# EAGLE design working (EAGLE 8.7.0)
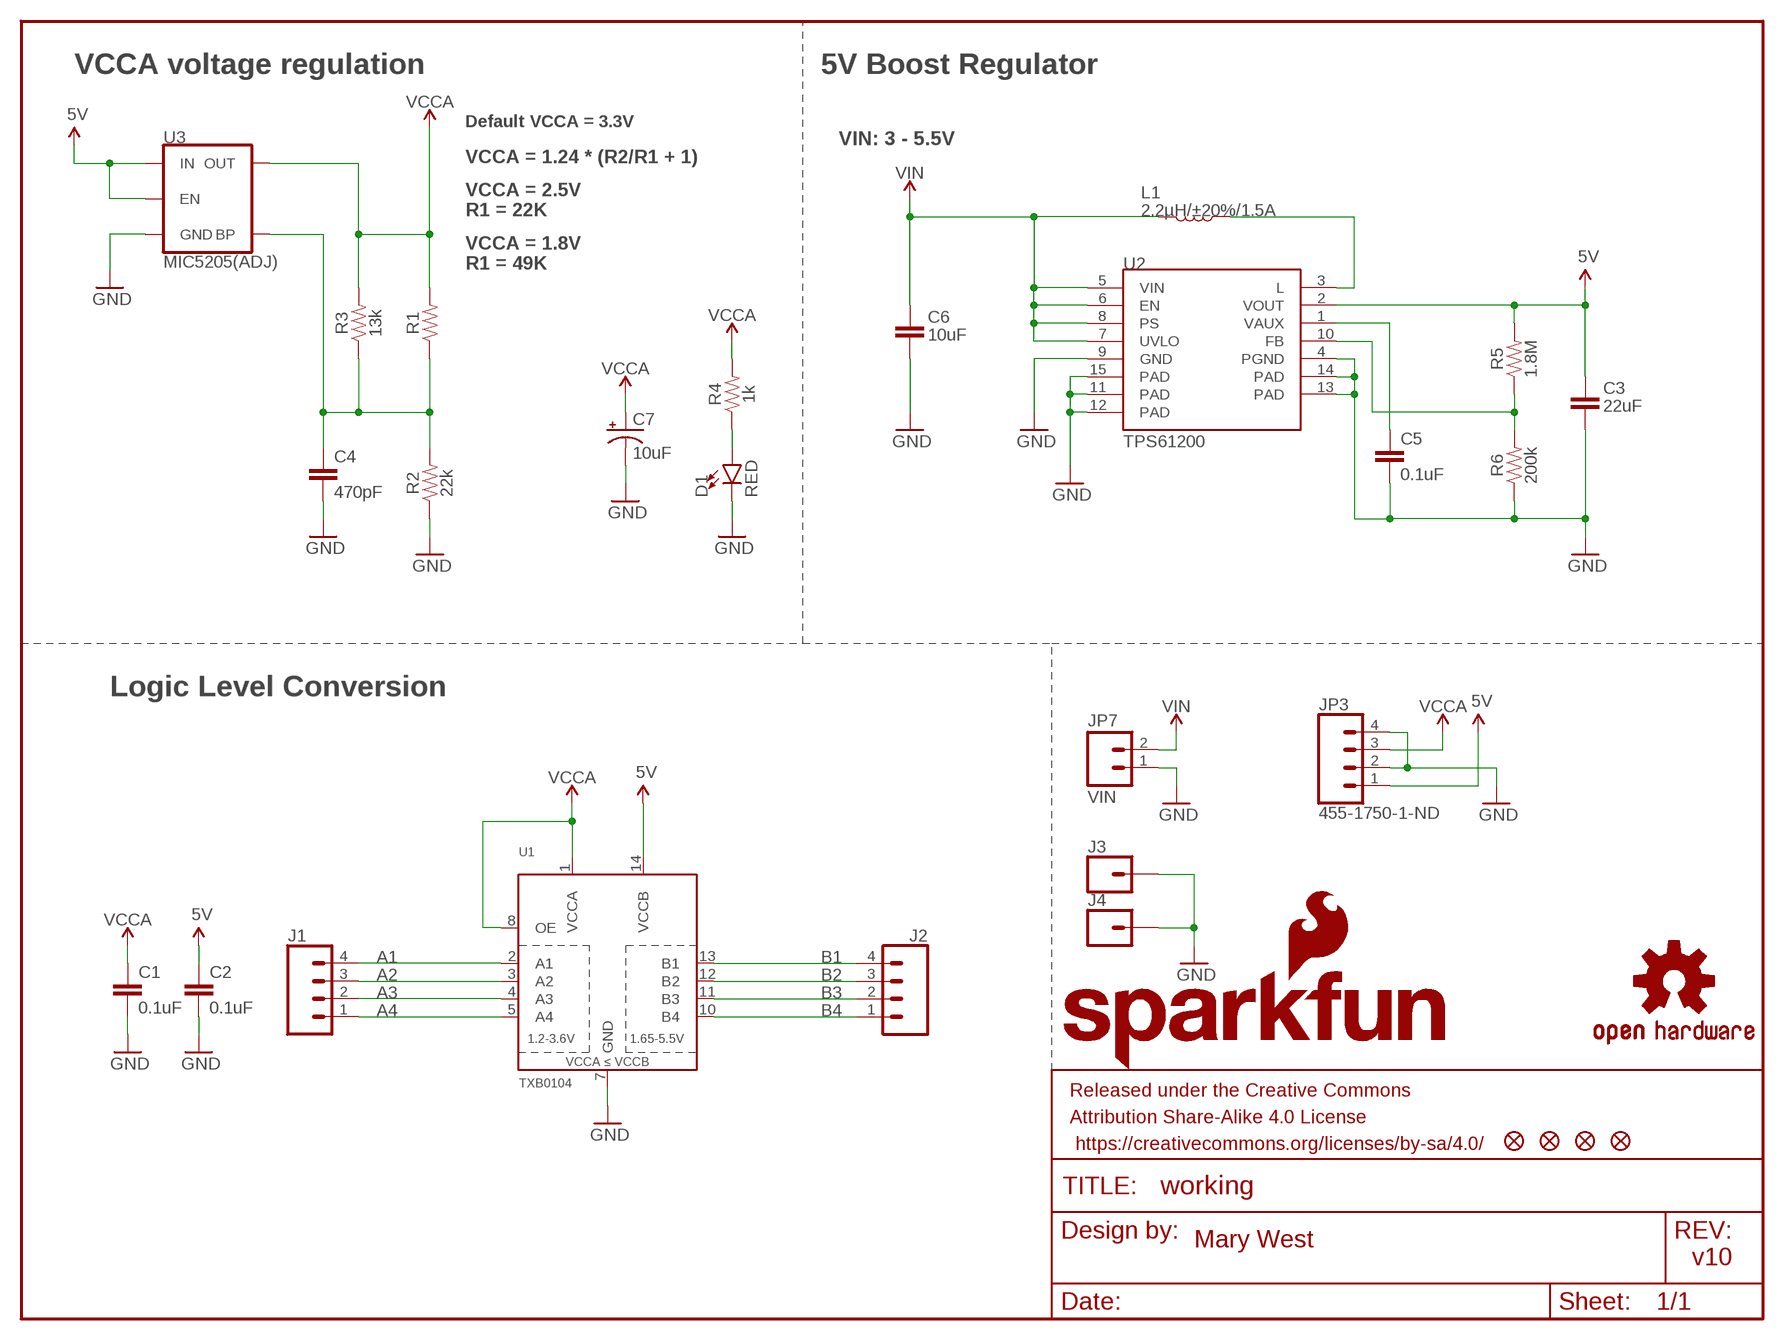
[diagram p0: schematic, sheet 1]

## Parts
C1  0.1uF  0.1UF-25V(+80/-20%)(0603)  [0603-CAP]
C2  0.1uF  0.1UF-25V(+80/-20%)(0603)  [0603-CAP]
C3  22uF  22UF-0805-6.3V-20%  [0805]
C4  470pF  470PF-0603-50V-5%  [0603]
C5  0.1uF  0.1UF-0603-25V-(+80/-20%)  [0603]
C6  10uF  10UF-0603-6.3V-20%  [0603]
C7  10uF  10UF-POLAR-EIA3216-16V-10%(TANT)  [EIA3216]
D1  RED  LED-RED0603  [LED-0603]
FD1  FIDUCIALUFIDUCIAL  [FIDUCIAL-MICRO]
FD2  FIDUCIALUFIDUCIAL  [FIDUCIAL-MICRO]
FD3  FIDUCIALUFIDUCIAL  [FIDUCIAL-MICRO]
FD4  FIDUCIALUFIDUCIAL  [FIDUCIAL-MICRO]
FRAME1  FRAME-LETTER  [CREATIVE_COMMONS]
J1  CONN_04  [1X04]
J2  CONN_04  [1X04]
J3  CONN_01  [1X01]
J4  CONN_01  [1X01]
JP3  455-1750-1-ND  CONN_04  [1X04]
JP7  VIN  M02PTH  [1X02]
L1  2.2µH/±20%/1.5A  INDUCTOR-VLF4012AT-2.2UH  [INDUCTOR_2.2UH]
LOGO1  SFE_LOGO_NAME_FLAME.1_INCH  [SFE_LOGO_NAME_FLAME_.1]
LOGO2  OSHW-LOGOS  [OSHW-LOGO-S]
R1  RESISTORAXIAL-0.3  [AXIAL-0.3]
R2  22k  22KOHM-0603-1/10W-1%  [0603]
R3  13k  13KOHM-0603-1/10W-1%  [0603]
R4  1k  1KOHM-0603-1/10W-1%  [0603]
R5  1.8M  1.8MOHM  [0603]
R6  200k  200KOHM-0603-1/10W-1%  [0603]
U1  TXB0104  TXB0104PWR  [TSSOP14]
U2  TPS61200  [QFN-10_PAD]
U3  MIC5205(ADJ)  V_REG_MIC5205ADJ  [SOT23-5]

## Nets
5V: C2.1 C3.1 JP3.1 R5.2 U1.14(VCCB) U2.2(VOUT) U3.1(IN) U3.3(EN)
A1: J1.4 U1.2(A1)
A2: J1.3 U1.3(A2)
A3: J1.2 U1.4(A3)
A4: J1.1 U1.5(A4)
B1: J2.4 U1.13(B1)
B2: J2.3 U1.12(B2)
B3: J2.2 U1.11(B3)
B4: J2.1 U1.10(B4)
FB: R5.1 R6.2 U2.10(FB)
GND: C1.2 C2.2 C3.2 C4.2 C5.2 C6.2 C7.- D1.C J3.1 J4.1 JP3.2 JP3.4 JP7.1 R2.1 R6.1 U1.7(GND) U2.4(PGND) U2.9(GND) U2.11(PAD) U2.12(PAD) U2.13(PAD) U2.14(PAD) U2.15(PAD) U3.2(GND)
N$3: D1.A R4.1
N$5: L1.P$1 U2.3(L)
N$6: C5.1 U2.1(VAUX)
N$11: C4.1 R1.P$1 R2.2 R3.1 U3.4(BP)
VCCA: C1.1 C7.+ JP3.3 R1.P$2 R3.2 R4.2 U1.1(VCCA) U1.8(OE) U3.5(OUT)
VIN: C6.1 JP7.2 L1.P$2 U2.5(VIN) U2.6(EN) U2.7(UVLO) U2.8(PS)

## Notes on the sheet
- VCCA voltage regulation | 5V Boost Regulator
- Default VCCA = 3.3V
- VIN: 3 - 5.5V
- VCCA = 1.24 * (R2/R1 + 1)
- VCCA = 2.5V
  R1 = 22K
- VCCA = 1.8V
  R1 = 49K
- Logic Level Conversion
- Mary West
- v10

## Library data of the parts
C1 C2 = SparkFun-Capacitors:0.1UF-25V(+80/-20%)(0603): Ceramic Standard decoupling cap CAP-00810; PROD_ID: CAP-00810
C3 = SparkFun-Capacitors:22UF: 22µF ceramic capacitors A capacitor is a passive two-terminal electrical component used to store electrical energy temporarily in an electric field.; PROD_ID: CAP-08402
C4 = SparkFun-Capacitors:470PF: 470pF ceramic capacitors A capacitor is a passive two-terminal electrical component used to store electrical energy temporarily in an electric field.; PROD_ID: CAP-07884
C5 = SparkFun-Capacitors:0.1UF: 0.1µF ceramic capacitors A capacitor is a passive two-terminal electrical component used to store electrical energy temporarily in an electric field.; PROD_ID: CAP-00810
C6 = SparkFun-Capacitors:10UF: 10.0µF ceramic capacitors A capacitor is a passive two-terminal electrical component used to store electrical energy temporarily in an electric field.; PROD_ID: CAP-11015
C7 = SparkFun-Capacitors:10UF-POLAR: 10.0µF polarized capacitors A capacitor is a passive two-terminal electrical component used to store electrical energy temporarily in an electric field.; PROD_ID: CAP-00811
D1 = SparkFun-LED:LED-RED: Red SMD LED Used in manufacturing of most products at SparkFun Packages: 0603 - SMD 0603 package [Product Link] <http://docs.avagotech.com/docs/AV02-0551EN> 0603 SMART - SMD 0603 SMART package ( more efficient and expensive)[Product Link] <http://www.osram-os.com/Graphics/XPic2/00077099_0.pdf> 1206 - SMD1206 package [Product Link] <https://www.sparkfun.com/datasheets/DevTools/LilyPad/Q150OVS4.pdff> SparkFun Products: Pro Mini 328 -5V <https://www.sparkfun.com/products/821> RedBoard <https://www.sparkfun.com/products/12757> IOIO-OTG <https://www.sparkfun.com/products/13613>; PROD_ID: DIO-00819
FD1-FD4 = SparkFun-Aesthetics:FIDUCIAL: Fiducial Alignment Points Point-of-reference for pick-and-place machines and other optical instruments.
FRAME1 = SparkFun-Aesthetics:FRAME-LETTER: Schematic Frame - Letter Standard 8.5x11 US Letter frame
J1 J2 JP3 = SparkFun-Connectors:CONN_04: Multi connection point. Often used as Generic Header-pin footprint for 0.1 inch spaced/style header connections On any of the 0.1 inch spaced packages, you can populate with these: Break Away Headers - Straight <https://www.sparkfun.com/products/116> (PRT-00116) Break Away Male Headers - Right Angle <https://www.sparkfun.com/products/553> (PRT-00553) Female Headers <https://www.sparkfun.com/products/115> (PRT-00115) Break Away Headers - Machine Pin <https://www.sparkfun.com/products/117> (PRT-00117) Break Away Female Headers - Swiss Machine Pin <https://www.sparkfun.com/products/743> (PRT-00743) For SCREWTERMINALS and SPRING TERMINALS visit here: Screw Terimnals on SparkFun.com <https://www.sparkfun.com/search/results?term=Screw+Terminals> (5mm/3.5mm/2.54mm spacing) This device is also useful as a general connection point to wire up your design to another part of your project. Our various solder wires solder well into these plated through hole pads. Hook-Up Wire - Assortment (Stranded, 22 AWG) <https://www.sparkfun.com/products/11375> (PRT-11375) Hook-Up Wire - Assortment (Solid Core, 22 AWG) <https://www.sparkfun.com/products/11367> (PRT-11367) View the entire wire category on our website here <https://www.sparkfun.com/categories/141> Special notes: Molex polarized connector foot print use with SKU : PRT-08231 with associated crimp pins and housings. 1MM SMD Version SKU: PRT-10208; PROD_ID: CONN-09696
J3 J4 = SparkFun-Connectors:CONN_01: Single connection point. Often used as Generic Header-pin footprint for 0.1 inch spaced/style header connections On any of the 0.1 inch spaced packages, you can populate with these: Break Away Headers - Straight <https://www.sparkfun.com/products/116> (PRT-00116) Break Away Male Headers - Right Angle <https://www.sparkfun.com/products/553> (PRT-00553) Female Headers <https://www.sparkfun.com/products/115> (PRT-00115) Break Away Headers - Machine Pin <https://www.sparkfun.com/products/117> (PRT-00117) Break Away Female Headers - Swiss Machine Pin <https://www.sparkfun.com/products/743> (PRT-00743) This device is also useful as a general connection point to wire up your design to another part of your project. Our various solder wires solder well into these plated through hole pads. Hook-Up Wire - Assortment (Stranded, 22 AWG) <https://www.sparkfun.com/products/11375> (PRT-11375) Hook-Up Wire - Assortment (Solid Core, 22 AWG) <https://www.sparkfun.com/products/11367> (PRT-11367) View the entire wire category on our website here <https://www.sparkfun.com/categories/141> Special notes: SMTSO-256-ET is a "flush mount" nut for a 4-40 screw. We mostly use this on specialty testbeds; it is a nice way to connect hardware to your PCB at an adjustable hieght. Also note, the SNAP packages are for using a snappable style connector. We sell a baggie of snaps and they are also used on two LilyPad designs: Snap Assortment - 30 pack (male and female) <https://www.sparkfun.com/products/11347> (DEV-11347) LilyPad Arduino SimpleSnap <https://www.sparkfun.com/products/10941> (DEV-10941) LilyPad SimpleSnap Protoboard <https://www.sparkfun.com/products/10940> (DEV-10940)
JP7 = SparkFun:M02: Header 2 Standard 2-pin 0.1" header. Use with straight break away headers (SKU : PRT-00116), right angle break away headers (PRT-00553), swiss pins (PRT-00743), machine pins (PRT-00117), and female headers (PRT-00115). Molex polarized connector foot print use with SKU : PRT-08233 with associated crimp pins and housings.
L1 = SparkFun-Coils:INDUCTOR: Inductors Resist changes in electrical current. Basically a coil of wire. SparkFun Products: SparkFun Load Cell Amplifier - HX711 <https://www.sparkfun.com/products/13879> IOIO-OTG - V2.2 <https://www.sparkfun.com/products/13613>; PROD_ID: NDUC-09513
LOGO1 = SparkFun-Aesthetics:SFE_LOGO_NAME_FLAME: SparkFun Font Logo w/ Flame This is the SparkFun full logo. The logo on the schematic will always be the same size; the package variant is the height of the flame part of the logo. Default layer for the logo on the board is tSilk.
LOGO2 = SparkFun-Aesthetics:OSHW-LOGO: Open-Source Hardware (OSHW) Logo This logo indicates the piece of hardware it is found on incorporates a OSHW license and/or adheres to the definition of open source hardware found here: http://freedomdefined.org/OSHW
R1 = SparkFun-Resistors:RESISTOR: Generic Resistor Package
R2 = SparkFun-Resistors:22KOHM: 22kΩ resistor A resistor is a passive two-terminal electrical component that implements electrical resistance as a circuit element. Resistors act to reduce current flow, and, at the same time, act to lower voltage levels within circuits. - Wikipedia; PROD_ID: RES-07853
R3 = SparkFun-Resistors:13KOHM: 13kΩ resistor A resistor is a passive two-terminal electrical component that implements electrical resistance as a circuit element. Resistors act to reduce current flow, and, at the same time, act to lower voltage levels within circuits. - Wikipedia; PROD_ID: RES-14017
R4 = SparkFun-Resistors:1KOHM: 1kΩ resistor A resistor is a passive two-terminal electrical component that implements electrical resistance as a circuit element. Resistors act to reduce current flow, and, at the same time, act to lower voltage levels within circuits. - Wikipedia; PROD_ID: RES-07856
R5 = SparkFun-Resistors:1.8MOHM: 1.8 MOhms ±5% 0.1W, 1/10W Chip Resistor 0603; PROD_ID: RES-13994
R6 = SparkFun-Resistors:200KOHM: 200kΩ resistor A resistor is a passive two-terminal electrical component that implements electrical resistance as a circuit element. Resistors act to reduce current flow, and, at the same time, act to lower voltage levels within circuits. - Wikipedia; PROD_ID: RES-09385
U1 = SparkFun-IC-Comms:TXB0104PWR: 4-Bit Bi-Directional Level Shifter 1.2V-3.6V (VCCA) to 1.65V-5.5V (VCCB) bi-directional level shifter with auto direction sensing. Max data rate - VCCA 1.8V: 20Mbps (50ns), VCCA 3.3V: 100Mbps (10ns) Digikey: 296-21929-1-ND (TSSOP) Datasheet <http://cdn.sparkfun.com/datasheets/BreakoutBoards/txb0104.pdf> SparkFun Products SparkFun Cellular Shield - MG2639 <https://www.sparkfun.com/products/13120> (CEL-13120) SparkFun Level Shifting microSD Breakout <https://www.sparkfun.com/products/13743> (DEV-13743) SparkFun Voltage-Level Translator Breakout - TXB0104 <https://www.sparkfun.com/products/11771> (BOB-11771) SparkFun Block for Intel® Edison - UART <https://www.sparkfun.com/products/13040> (DEV-13040) SparkFun Block for Intel® Edison - Arduino <https://www.sparkfun.com/products/13036> (DEV-13036); PROD_ID: IC-13929
U2 = SparkFun-IC-Power:TPS61200: DC to DC Booster IC-10035; PROD_ID: IC-10035
U3 = SparkFun-IC-Power:V_REG_MIC5205: V_REG MIC5205 Standard 3.3V, 5V, and Adjustable 150mA LDO voltage regulator in SOT-23 layout. Micrel part MIC5205. BP (by-pass) pin is used to lower output noise with 470pF cap, may be left open. On the adjustable version BP is used to set output.; PROD_ID: VREG-12594

## Net classes
0 Default: width 0.203 mm
1 VCC: width 0.254 mm

## Board
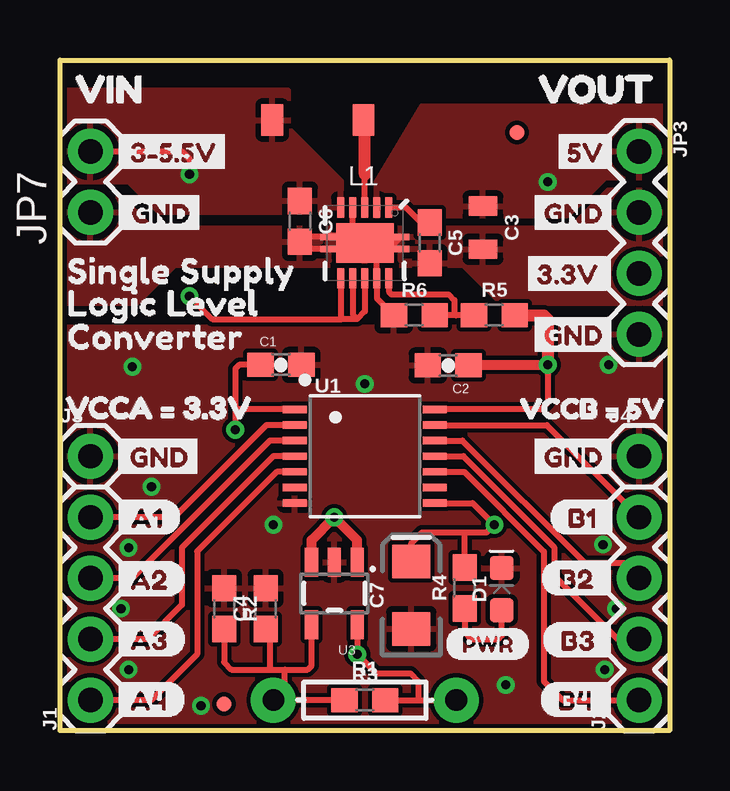
[diagram p1: board, top side]
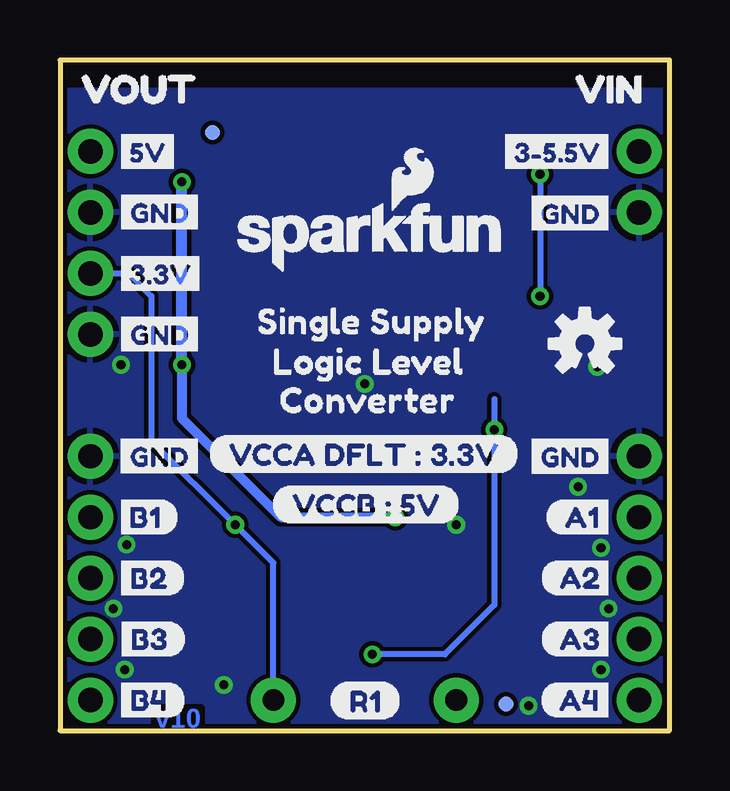
[diagram p2: board, bottom side, seen from below]

Size 25.4 x 27.94 mm. Coordinates in mm from the lower left corner, seen from the top.
Outline: 0,0 0,27.94 25.4,27.94 25.4,0 0,0
Copper layers (1*16): Top 0.035mm / dielectric 1.5mm / Bottom 0.035mm
Design rules "SparkFun-2-layer-TIGHT": minimum track width 7mil, minimum drill 15mil, track to track 7mil, track to pad 7mil, pad to pad 7mil, via to via 7mil, smd to smd 7mil, copper to edge 7mil, drill to drill 7mil, minimum pad ring 7mil, minimum via ring 7mil, stop-mask expansion 4mil, vias tented up to drill 25mil, thermal gap 10mil

### Footprints (pad centres in the part's own frame; a part is rotated, then mirrored left to right if it is on the bottom)
0603-CAP = smd 1.1 x 1: 1 -0.85,0; 2 0.85,0
0805 = smd 0.8 x 1.2: 1 -0.9,0; 2 0.9,0
0603 = smd 1.1 x 1: 1 -0.85,0; 2 0.85,0
EIA3216 = smd 1.4 x 1.6: + 1.4,0; - -1.4,0
LED-0603 = smd 1 x 1: A -0.877,0; C 0.877,0
FIDUCIAL-MICRO = smd 0.635 x 0.635: 1 0,0
1X04 = drill 1.016 pad 1.88: 1 0,0; 2 2.54,0; 3 5.08,0; 4 7.62,0
1X01 = drill 1.016 pad 1.88: 1 0,0
1X02 = drill 1.016 pad 1.88: 1 0,0; 2 2.54,0
INDUCTOR_2.2UH = smd 0.9 x 1.3: P$1 -1.9,0; P$2 1.9,0
AXIAL-0.3 = drill 0.9 pad 1.88: P$1 -3.81,0; P$2 3.81,0
TSSOP14 = smd 0.305 x 0.991: 1 -1.95,-2.918; 2 -1.3,-2.918; 3 -0.65,-2.918; 4 0,-2.918; 5 0.65,-2.918; 6 1.3,-2.918; 7 1.95,-2.918; 8 1.95,2.918; 9 1.3,2.918; 10 0.65,2.918; 11 0,2.918; 12 -0.65,2.918; 13 -1.3,2.918; 14 -1.95,2.918
QFN-10_PAD = smd 0.297 x 0.85: 1 -1,-1.475; 2 -0.5,-1.475; 3 0,-1.475; 4 0.5,-1.475; 5 1,-1.475; 6 1,1.475; 7 0.5,1.475; 8 0,1.475; 9 -0.5,1.475; 10 -1,1.475 | smd 0.7 x 0.28: 11 -1.5,0.25; 12 -1.5,-0.25; 13 1.5,0.25; 14 1.5,-0.25 | smd 2.4 x 1.65: 15 0,0
SOT23-5 = smd 0.55 x 1.2: 1 -0.95,-1.3; 2 0,-1.3; 3 0.95,-1.3; 4 0.95,1.3; 5 -0.95,1.3

### Placement (x,y rotation side)
C1  9.21,15.24 0 top
C2  16.17,15.21 180 top
C3  17.62,20.95 270 top
C4  8.57,5.08 90 top
C5  15.4,20.32 270 top
C6  10,21.22 270 top
C7  14.64,5.64 90 top
D1  18.4,5.89 90 top
FD1  19.05,24.92 0 top
FD2  19.05,24.92 0 bottom
FD3  6.83,1.11 0 top
FD4  6.83,1.11 0 bottom
FRAME1  -4.95,-10.19 0 top  (outside the outline)
J1  1.27,1.27 90 top
J2  24.13,1.27 90 top
J3  1.27,11.43 0 top
J4  24.13,11.43 0 top
JP3  24.13,24.13 270 top
JP7  1.27,21.59 90 top
L1  10.74,25.44 180 top
LOGO1  18.41,19.05 0 bottom
LOGO2  3.53,16.12 0 bottom
R1  12.7,1.27 0 top
R2  6.84,5.08 270 top
R3  12.7,1.27 0 top
R4  16.86,5.94 90 top
R5  18.1,17.3 0 top
R6  14.76,17.3 0 top
U1  12.7,11.43 270 top
U2  12.7,20.32 180 top
U3  11.43,5.71 180 top
U$7  [GND0]  2.18,21.59 0 top
U$8  [VIN1]  4.83,26.67 0 bottom
U$9  [A10]  5.18,8.89 0 bottom
U$10  [CONVERTER0]  -0.64,16.4 0 top
U$11  [LOGIC_LEVEL2]  -0.63,17.8 0 top
U$12  [SINGLE_SUPPLY1]  -0.64,19.14 0 top
U$13  [B1_12]  20.35,8.89 0 top
U$14  [A21]  5.42,6.36 0 bottom
U$15  [A32]  5.42,3.81 0 bottom
U$16  [A43]  5.4,1.27 0 bottom
U$17  [B14]  23.32,8.89 0 bottom
U$18  [B25]  23.32,6.35 0 bottom
U$19  [B2_11]  19.99,6.35 0 top
U$20  [B3_10]  20.04,3.78 0 top
U$21  [3#5#5V3]  2.13,24.13 0 top
U$22  [B4_9]  19.94,1.3 0 top
U$23  [3#3V2]  19.05,19.05 0 top
U$24  [GND0]  2.11,11.43 0 top
U$25  [A14]  2.16,8.89 0 top
U$26  [A28]  2.11,6.32 0 top
U$27  [VOUT2]  25.4,26.67 0 bottom
U$28  [A35]  2.11,3.81 0 top
U$29  [PWR0]  16.01,3.6 0 top
U$30  [A46]  2.13,1.3 0 top
U$31  [GND0]  19.37,21.59 0 top
U$32  [5V1]  20.32,24.13 0 top
U$33  [B36]  23.29,3.81 0 bottom
U$34  [GND0]  19.37,11.43 0 top
U$35  [GND0]  19.37,16.51 0 top
U$36  [VCCA_#_3#3V0]  -0.69,13.51 0 top
U$38  [VIN1]  -0.25,26.67 0 top
U$39  [3#5#5V3]  7.28,24.13 0 bottom
U$40  [GND0]  6.16,21.56 0 bottom
U$41  [GND0]  6.17,11.43 0 bottom
U$42  [B47]  23.27,1.27 0 bottom
U$43  [CONVERTER0]  17.2,13.77 0 bottom
U$44  [VOUT2]  19.05,26.67 0 top
U$45  [LOGIC_LEVEL2]  17.48,15.37 0 bottom
U$46  [SINGLE_SUPPLY1]  18.11,17.04 0 bottom
U$47  [VCCA_DFLT_#_3#3V0]  19.23,11.53 0 bottom
U$48  [VCCB_#_5V0]  16.59,9.42 0 bottom
U$49  [R10]  14.22,1.24 0 bottom
U$51  [5V1]  23.31,24.13 0 bottom
U$52  [GND0]  23.27,21.6 0 bottom
U$53  [3#3V2]  23.32,19.05 0 bottom
U$54  [GND0]  23.27,16.52 0 bottom
U$55  [GND0]  23.28,11.44 0 bottom
U$56  [VCCB_#_5V1]  18.26,13.51 0 top

### Tracks (layer width: path | path; a pad name or v marks a point on that pad's centre or on a via)
5V  (via drill 0.38)
  Top 0.254: v20.32,15.24 20.32,13.65 20.05,13.38 U1.14 | C2.1 17.05,15.24 17.37,15.24
  Top 0.406: U3.1 12.38,7.94 v11.43,8.89 10.48,7.94 U3.3 | 17.37,15.24 v20.32,15.24
  Top 0.508: R5.2 20.16,17.3 20.32,17.14 v20.32,15.24
  Bottom 0.406: 20.32,15.13 v20.32,15.24 20.32,13.02 16.19,8.89 v11.43,8.89
  Bottom 0.457: v20.32,15.24 v20.32,22.86
  pour Top: 13.18,21.43 13.18,22.86 15.08,26.04 25.4,26.04 25.4,23.02 22.7,23.02 21.11,21.43
A1
  Top 0.254: U1.2 8.6,12.73 4.76,8.89 J1.4
A2
  Top 0.254: U1.3 8.75,12.08 3.02,6.35 J1.3
A3
  Top 0.254: U1.4 8.89,11.43 5.08,7.62 5.08,5.24 3.65,3.81 J1.2
A4
  Top 0.254: U1.5 9.03,10.78 5.71,7.46 5.71,3.17 3.81,1.27 J1.1
B1
  Top 0.254: U1.13 20.29,12.73 J2.4
B2
  Top 0.254: J2.3 23.5,6.99 21.86,6.99 16.76,12.08 U1.12
B3
  Top 0.254: J2.2 23.24,3.81 20.59,6.46 20.59,7.64 16.8,11.43 U1.11
B4
  Top 0.254: J2.1 20.95,1.27 20.16,2.06 20.16,7.46 16.84,10.78 U1.10
FB
  Top 0.254: R5.1 16.51,17.3 | 16.51,17.3 R6.2 | 16.51,17.3 16.43,17.38 16.43,17.94 16.19,18.18 13.81,18.18 13.7,18.29 U2.10 13.7,18.68
GND  (via drill 0.38)
  Top 0.254: U2.4 12.2,20.82 12.38,20.64 | 13.34,20.32 13.2,20.18 U2.9 13.2,18.02 R6.1 | 13.34,20.32 13.02,20.32 | 13.02,20.32 U2.15 12.38,20.64 | U2.12 13.95,20.32 13.34,20.32 | 12.38,20.64 11.27,20.64 U2.14 10.2,20.57 C6.2 10.3,20.07 U2.13 | U2.11 13.27,20.07 13.02,20.32
  other vias: 3.02,15.16 12.7,14.45 22.86,15.24 2.54,5.08 22.63,7.75 2.86,2.54 22.7,2.54 18.57,1.91 2.86,7.62 23.18,5.08 3.81,10.16 8.89,8.57 5.87,1.03
  pour Bottom: 0,26.67 25.4,26.67 25.4,0 0,0
  pour Top: 0,16.83 25.32,16.83 25.4,0 0,0
  pour Top: 0,22.23 2.54,22.23 3.81,20.95 21.27,20.95 22.86,22.54 25.4,22.54 25.4,17.78 18.41,17.78 16.83,19.37 4.76,19.37 3.17,17.78 0,17.78
N$3
  Top 0.254: R4.1 16.86,4.09 17.14,3.81 18.26,3.81 18.41,3.97 18.4,3.98 D1.A
N$5
  Top 0.254: U2.3 12.7,23.18
  Top 0.508: L1.P$1 12.7,25.38 12.7,23.18
N$6
  Top 0.254: U2.1 14.4,21.8 15.03,21.17 C5.1
N$11
  Top 0.254: U3.4 10.48,2.7 10.32,2.54 9.37,2.54 | R3.1 R1.P$1 9.37,1.75 9.37,2.54 | R2.2 6.84,2.85 7.14,2.54 8.73,2.54 | 8.73,2.54 9.37,2.54 | C4.1 8.73,4.07 8.73,2.54
VCCA  (via drill 0.38)
  Top 0.254: U1.1 7.42,13.38 7.3,13.49 v7.3,12.54 7.3,15.08 7.46,15.24 C1.1 | U1.8 17.19,9.48 v18.1,8.57 17.78,8.26 16.83,8.26 | C7.+ 14.64,7.81 15.08,8.26 16.83,8.26 | 16.83,6.83 R4.2 16.86,8.22 16.83,8.26 | U3.5 v12.38,3.17 13.18,2.38 14.61,2.38 14.92,2.06 14.92,1.27 | R3.2 14.92,1.27 | 14.92,1.27 R1.P$2
  Bottom 0.254: JP3.3 22.54,19.05 21.59,18.1 21.59,12.06 v18.1,8.57 16.51,6.99 R1.P$2 | 7.3,13.81 v7.3,12.54 7.3,5.24 9.37,3.17 v12.38,3.17
VIN  (via drill 0.38)
  Top 0.254: U2.8 12.7,17.46 12.38,17.14 | 12.38,17.14 11.75,17.14 | U2.7 12.2,17.33 12.38,17.14 | U2.6 11.7,17.19 11.75,17.14 | v5.4,23.18 5.4,23.81 5.08,24.13 JP7.2 | v5.4,18.1 6.35,17.14 11.75,17.14
  Bottom 0.254: v5.4,23.18 v5.4,18.1
  pour Top: 11.75,21.59 11.75,22.86 9.53,25.08 9.53,26.67 0,26.67 0,22.86 2.86,22.86 4.13,21.59

### Text on the board
Bottom: v10
Measures: All Units in Inches
tDocu: Mary West